# Altium project LED_CUBE_5x5x5.PrjPCB
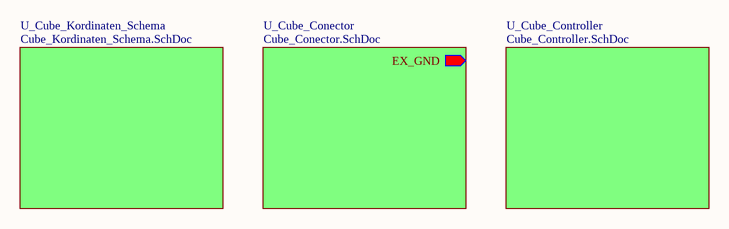
[diagram p0: main.SchDoc]
7 sheets, 116 parts. Net scope: hierarchical (ports join the sheet entries above them; power ports are global).
Board files: Cube_Connector.PcbDoc, Cube_Mainboard.PcbDoc
Sheets:
  main.SchDoc
    U_Cube_Kordinaten_Schema = Cube_Kordinaten_Schema.SchDoc
    U_Cube_Conector = Cube_Conector.SchDoc
    U_Cube_Controller = Cube_Controller.SchDoc
      U_LED_Treiber = LED_Treiber.SchDoc
      U_LED_GND_ZLayer_switch = LED_GND_ZLayer_switch.SchDoc
      U_USB_Programmer = USB_Programmer.SchDoc

## Sheet main.SchDoc
size A4

### Sub-sheets
U_Cube_Conector = Cube_Conector.SchDoc: EX_GND (out)
U_Cube_Controller = Cube_Controller.SchDoc: no entries
U_Cube_Kordinaten_Schema = Cube_Kordinaten_Schema.SchDoc: no entries

## Sheet Cube_Kordinaten_Schema.SchDoc
size A2
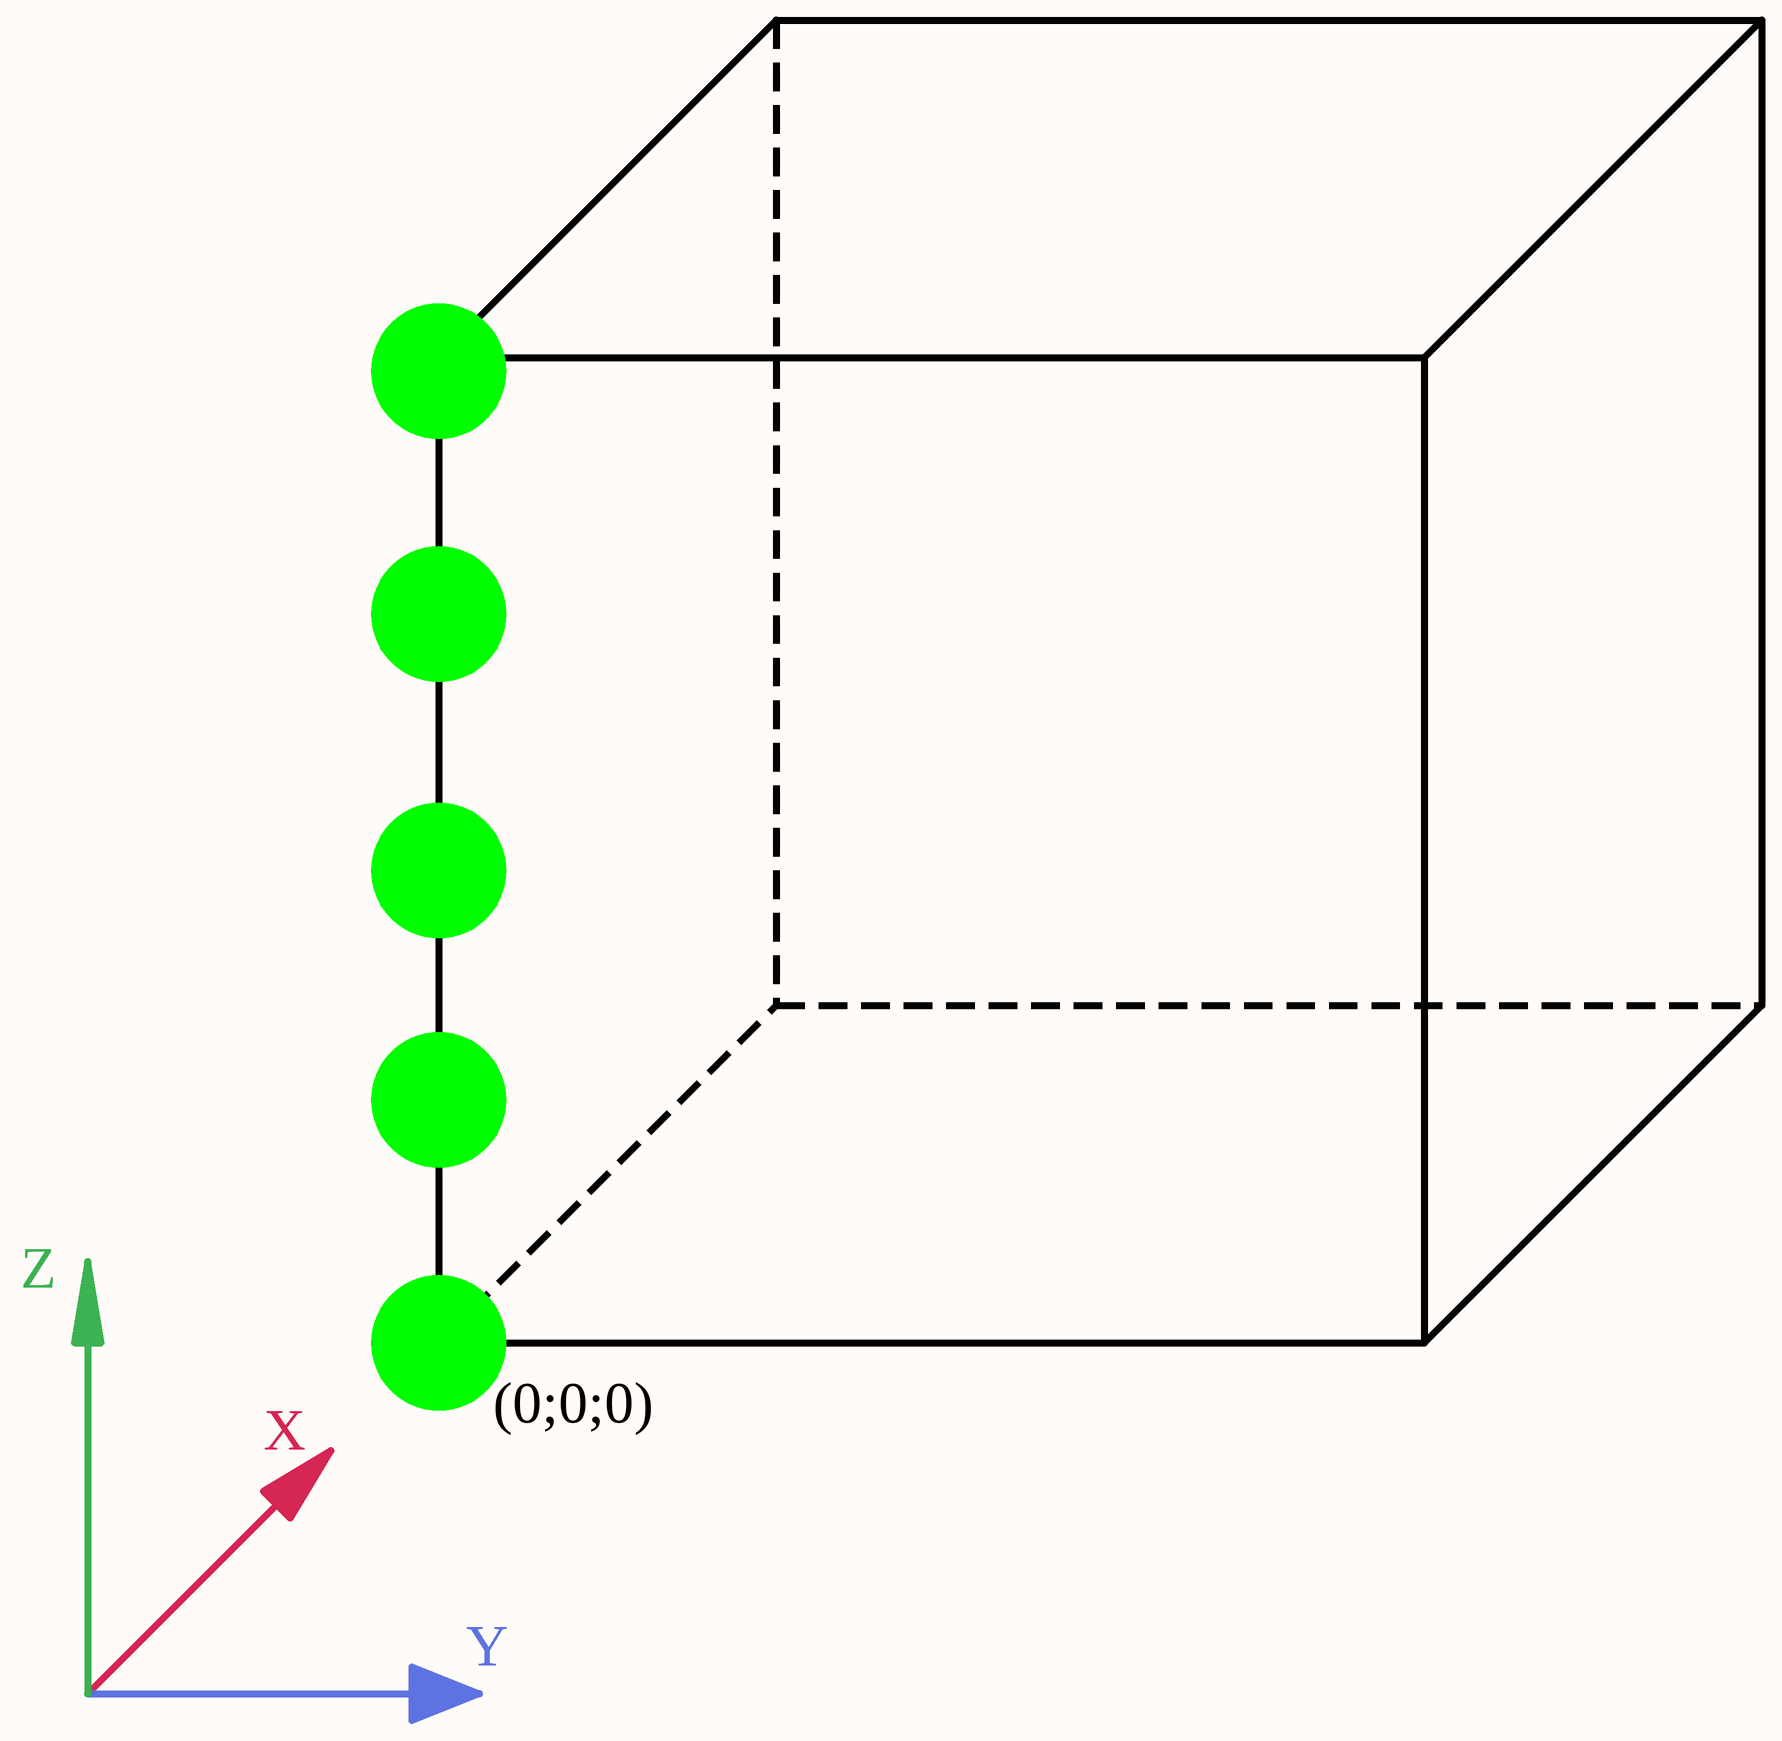
[diagram p1: Cube_Kordinaten_Schema.SchDoc]

### Notes on the sheet
- Z
- X
- (0;0;0)
- Y

## Sheet Cube_Conector.SchDoc
size A2
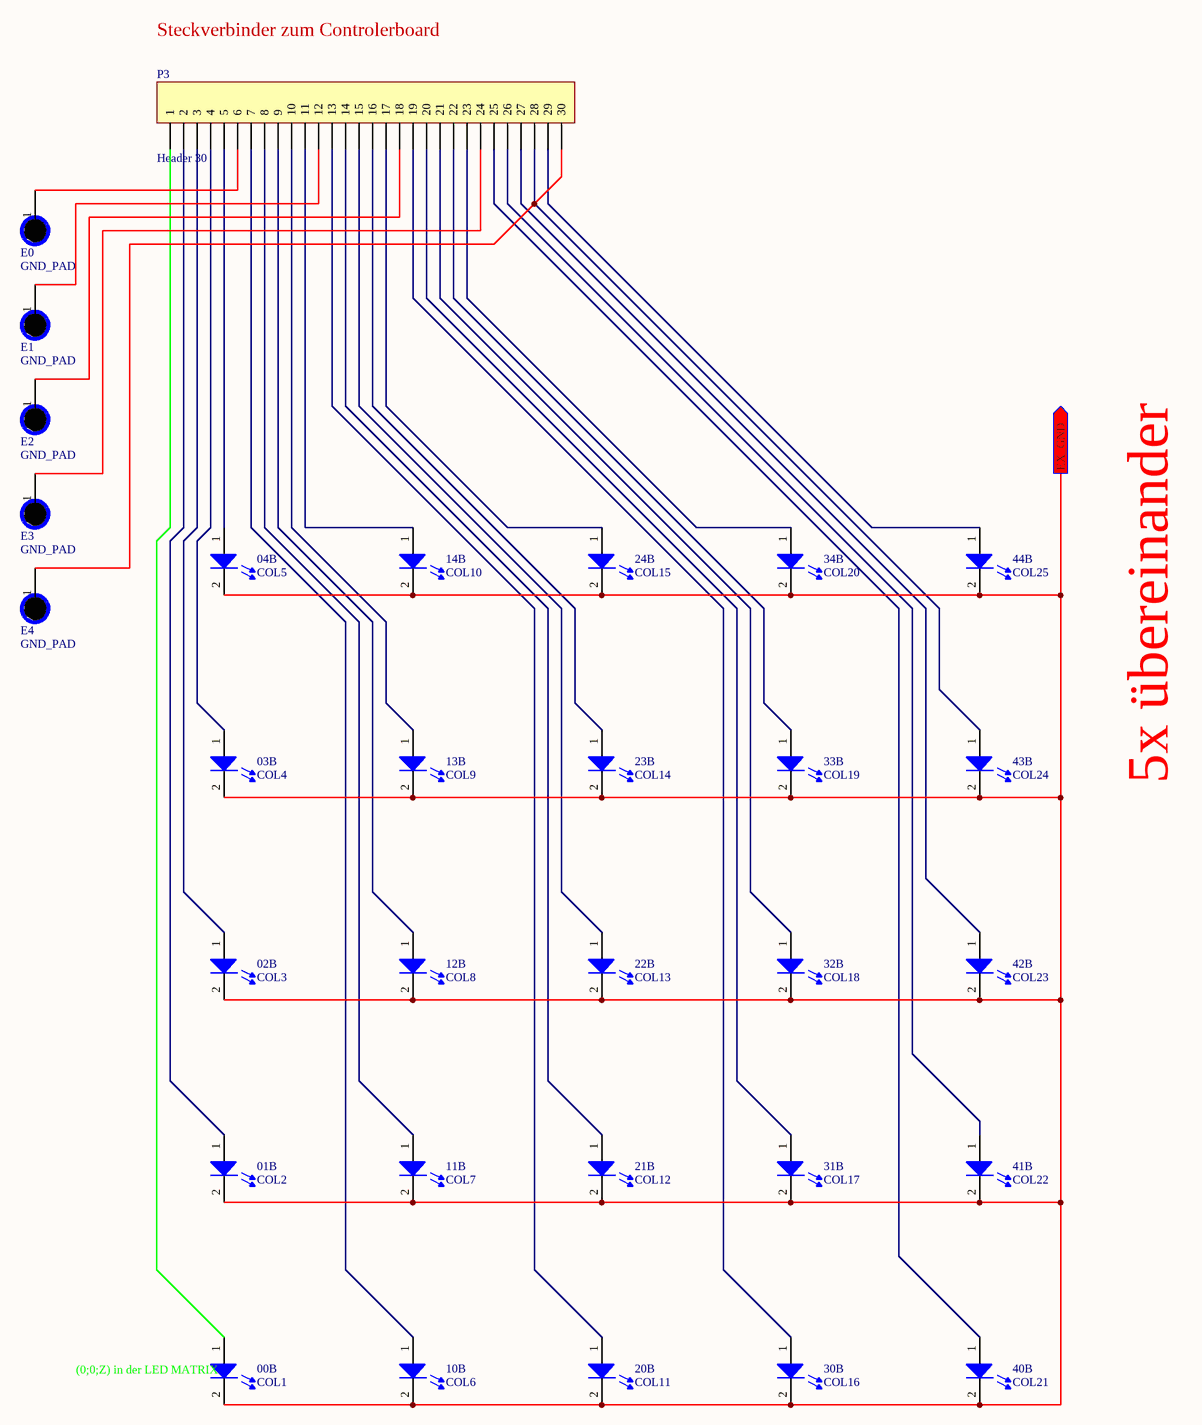
[diagram p2: Cube_Conector.SchDoc]

### Parts
00  COL1  [LED 3mm]  (part B of 2)
01  COL2  [LED 3mm]  (part B of 2)
02  COL3  [LED 3mm]  (part B of 2)
03  COL4  [LED 3mm]  (part B of 2)
04  COL5  [LED 3mm]  (part B of 2)
10  COL6  [LED 3mm]  (part B of 2)
11  COL7  [LED 3mm]  (part B of 2)
12  COL8  [LED 3mm]  (part B of 2)
13  COL9  [LED 3mm]  (part B of 2)
14  COL10  [LED 3mm]  (part B of 2)
20  COL11  [LED 3mm]  (part B of 2)
21  COL12  [LED 3mm]  (part B of 2)
22  COL13  [LED 3mm]  (part B of 2)
23  COL14  [LED 3mm]  (part B of 2)
24  COL15  [LED 3mm]  (part B of 2)
30  COL16  [LED 3mm]  (part B of 2)
31  COL17  [LED 3mm]  (part B of 2)
32  COL18  [LED 3mm]  (part B of 2)
33  COL19  [LED 3mm]  (part B of 2)
34  COL20  [LED 3mm]  (part B of 2)
40  COL21  [LED 3mm]  (part B of 2)
41  COL22  [LED 3mm]  (part B of 2)
42  COL23  [LED 3mm]  (part B of 2)
43  COL24  [LED 3mm]  (part B of 2)
44  COL25  [LED 3mm]  (part B of 2)
E0  GND_PAD  [GND_PAD]
E1  GND_PAD  [GND_PAD]
E2  GND_PAD  [GND_PAD]
E3  GND_PAD  [GND_PAD]
E4  GND_PAD  [GND_PAD]
P3  Header 30  [HDR1X30]

### Ports
EX_GND (out)

### Nets
Net00_1: 00.1 P3.1
Net00_2: 00.2 01.2 02.2 03.2 04.2 10.2 11.2 12.2 13.2 14.2 20.2 21.2 22.2 23.2 24.2 30.2 31.2 32.2 33.2 34.2 40.2 41.2 42.2 43.2 44.2 ; port EX_GND
Net01_1: 01.1 P3.2
Net02_1: 02.1 P3.3
Net03_1: 03.1 P3.4
Net04_1: 04.1 P3.5
Net10_1: 10.1 P3.7
Net11_1: 11.1 P3.8
Net12_1: 12.1 P3.9
Net13_1: 13.1 P3.10
Net14_1: 14.1 P3.11
Net20_1: 20.1 P3.13
Net21_1: 21.1 P3.14
Net22_1: 22.1 P3.15
Net23_1: 23.1 P3.16
Net24_1: 24.1 P3.17
Net30_1: 30.1 P3.19
Net31_1: 31.1 P3.20
Net32_1: 32.1 P3.21
Net33_1: 33.1 P3.22
Net34_1: 34.1 P3.23
Net40_1: 40.1 P3.25
Net41_1: 41.1 P3.26
Net42_1: 42.1 P3.27
Net43_1: 43.1 E4.1(GND) P3.28 P3.30
Net44_1: 44.1 P3.29
NetE0_1: E0.1(GND) P3.6
NetE1_1: E1.1(GND) P3.12
NetE2_1: E2.1(GND) P3.18
NetE3_1: E3.1(GND) P3.24

### Notes on the sheet
- Steckverbinder zum Controlerboard
- 5x übereinander
- (near 00) (0;0;Z) in der LED MATRIX

### Library data of the parts
00 01 02 03 04 10-14 20-24 30-34 40-44 = LED Std: LED bedrahtet
P3 = Header 30: Header, 30-Pin; LatestRevisionDate: 17-Jul-2002; LatestRevisionNote: Re-released for DXP Platform.; Publisher: Altium Limited

## Sheet Cube_Controller.SchDoc
size A3; DrawnBy: Tobias Wulf
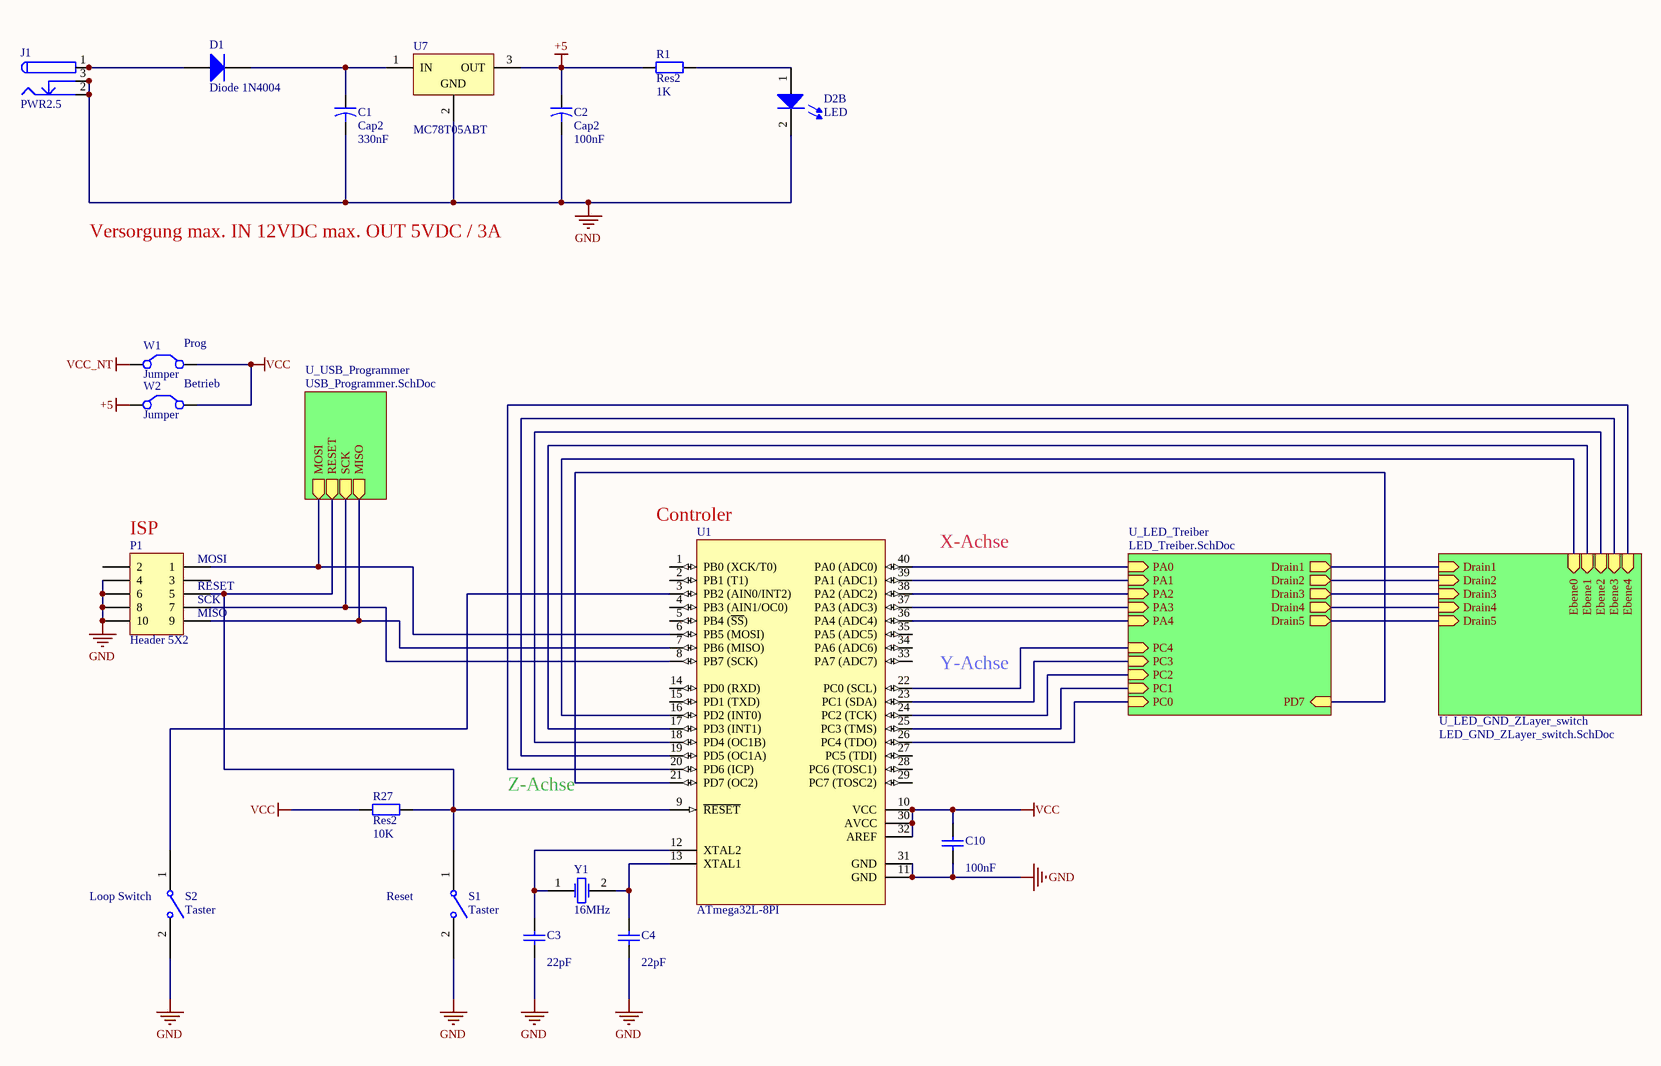
[diagram p3: Cube_Controller.SchDoc]

### Parts
C1  Cap2  value 330nF  [RAD-0.1]
C2  Cap2  value 100nF  [RAD-0.1]
C3  value 22pF  [RAD-0.1]  (hidden comment: Cap Semi)
C4  value 22pF  [RAD-0.1]  (hidden comment: Cap Semi)
C10  value 100nF  [RAD-0.1]  (hidden comment: Cap)
D1  Diode 1N4004  [DO-41]
D2  LED  [LED 3mm]  (part B of 2)
J1  PWR2.5  [KLD-0202]
P1  Header 5X2  [HDR2X5]
R1  Res2  value 1K  [AXIAL-0.4]
R27  Res2  value 10K  [AXIAL-0.4]
S1  Taster  [Taster]
S2  Taster  [Taster]
U1  ATmega32L-8PI  [40P6]
U7  MC78T05ABT  [221A-04]
W1  Jumper  [HDR1X2]
W2  Jumper  [HDR1X2]
Y1  16MHz  [Quarz HC49-4HL]

### Sub-sheets
U_LED_GND_ZLayer_switch = LED_GND_ZLayer_switch.SchDoc: Ebene0 (in), Ebene1 (in), Ebene2 (in), Ebene3 (in), Ebene4 (in), Drain1 (in), Drain2 (in), Drain3 (in), Drain4 (in), Drain5 (in)
U_LED_Treiber = LED_Treiber.SchDoc: PA0 (in), PA1 (in), PA2 (in), PA3 (in), PA4 (in), PC0 (in), PD7 (in), PC1 (in), PC2 (in), PC3 (in), PC4 (in), Drain1 (out), Drain2 (out), Drain3 (out), Drain4 (out), Drain5 (out)
U_USB_Programmer = USB_Programmer.SchDoc: MOSI (out), RESET (out), SCK (out), MISO (out)

### Nets
+5: C2.1 R1.1 U7.3(OUT) W2.1(C1)
GND: C1.2 C2.2 C3.1 C4.1 C10.1 D2.2 J1.2 J1.2A J1.2B J1.3 J1.3A J1.3B P1.4 P1.6 P1.8 P1.10 S1.2 S2.2 U1.11(GND) U1.31(GND) U7.2(GND)
VCC: C10.2 R27.1 U1.10(VCC) U1.30(AVCC) U1.32(AREF) W1.2(C2) W2.2(C2)
VCC_NT: W1.1(C1)  [project net +5P]
NetC1_1: C1.1 D1.2(K) U7.1(IN)
NetC3_2: C3.2 U1.12(XTAL2) Y1.1
NetC4_2: C4.2 U1.13(XTAL1) Y1.2
NetD1_1: D1.1(A) J1.1 J1.1A J1.1B
NetD2_1: D2.1 R1.2
NetP1_1: P1.1 U1.6(PB5_(MOSI)) ; sheet U_USB_Programmer/MOSI
NetP1_5: P1.5 R27.2 S1.1 U1.9(~{RESET}) ; sheet U_USB_Programmer/RESET
NetP1_7: P1.7 U1.8(PB7_(SCK)) ; sheet U_USB_Programmer/SCK
NetP1_9: P1.9 U1.7(PB6_(MISO)) ; sheet U_USB_Programmer/MISO
NetP2_6: sheet U_LED_Treiber/Drain1, sheet U_LED_GND_ZLayer_switch/Drain1
NetP2_12: sheet U_LED_Treiber/Drain2, sheet U_LED_GND_ZLayer_switch/Drain2
NetP2_18: sheet U_LED_Treiber/Drain3, sheet U_LED_GND_ZLayer_switch/Drain3
NetP2_24: sheet U_LED_Treiber/Drain4, sheet U_LED_GND_ZLayer_switch/Drain4
NetP2_30: sheet U_LED_Treiber/Drain5, sheet U_LED_GND_ZLayer_switch/Drain5
NetR28_1: U1.16(PD2_(INT0)) ; sheet U_LED_GND_ZLayer_switch/Ebene0
NetR29_1: U1.17(PD3_(INT1)) ; sheet U_LED_GND_ZLayer_switch/Ebene1
NetR30_1: U1.18(PD4_(OC1B)) ; sheet U_LED_GND_ZLayer_switch/Ebene2
NetR31_1: U1.19(PD5_(OC1A)) ; sheet U_LED_GND_ZLayer_switch/Ebene3
NetR32_1: U1.20(PD6_(ICP)) ; sheet U_LED_GND_ZLayer_switch/Ebene4
NetS2_1: S2.1 U1.3(PB2_(AIN0/INT2))
NetU1_21: U1.21(PD7_(OC2)) ; sheet U_LED_Treiber/PD7
NetU1_22: U1.22(PC0_(SCL)) ; sheet U_LED_Treiber/PC4
NetU1_23: U1.23(PC1_(SDA)) ; sheet U_LED_Treiber/PC3
NetU1_24: U1.24(PC2_(TCK)) ; sheet U_LED_Treiber/PC2
NetU1_25: U1.25(PC3_(TMS)) ; sheet U_LED_Treiber/PC1
NetU1_26: U1.26(PC4_(TDO)) ; sheet U_LED_Treiber/PC0
NetU1_36: U1.36(PA4_(ADC4)) ; sheet U_LED_Treiber/PA4
NetU1_37: U1.37(PA3_(ADC3)) ; sheet U_LED_Treiber/PA3
NetU1_38: U1.38(PA2_(ADC2)) ; sheet U_LED_Treiber/PA2
NetU1_39: U1.39(PA1_(ADC1)) ; sheet U_LED_Treiber/PA1
NetU1_40: U1.40(PA0_(ADC0)) ; sheet U_LED_Treiber/PA0

Not connected (* = marked no-connect by the designer): P1 2 3; U1 1(PB0_(XCK/T0)) 2(PB1_(T1)) 4(PB3_(AIN1/OC0)) 5(PB4_(~{SS})) 14(PD0_(RXD)) 15(PD1_(TXD)) 27(PC5_(TDI)) 28(PC6_(TOSC1)) 29(PC7_(TOSC2)) 33(PA7_(ADC7)) 34(PA6_(ADC6)) 35(PA5_(ADC5))

### Notes on the sheet
- Versorgung max. IN 12VDC max. OUT 5VDC / 3A
- (near W1) Prog
- Betrieb
- (near U1) Controler
- (near P1) ISP
- (near P1) RESET
- (near P1) MOSI
- X-Achse
- (near P1) MISO
- (near P1) SCK
- Y-Achse
- Z-Achse
- (near S2) Loop Switch
- (near S1) Reset

### Library data of the parts
C1 C2 = Cap2: Capacitor; Published: 23-Sep-2002; PackageReference: CAPR5-4X5; Publisher: Altium Limited; PackageDescription: Capacitor; 2 Leads
C3 C4 = Cap Semi: Capacitor (Semiconductor SIM Model); Published: 8-Jun-2000; LatestRevisionDate: 29-May-2009; LatestRevisionNote: IPC-7351 Footprint Added.; PackageReference: C1206; Publisher: Altium Limited; PackageDescription: Chip Capacitor
C10 = Cap: Capacitor; Published: 8-Jun-2000; LatestRevisionDate: 17-Jul-2002; LatestRevisionNote: Re-released for DXP Platform.; PackageReference: RAD-0.3; Publisher: Altium Limited; PackageDescription: Radial Cap, Thru-Hole; 2 Leads; 0.3 in Pin Spacing
D1 = Diode 1N4004: 1 Amp General Purpose Rectifier; Published: 8-Jun-2000; LatestRevisionDate: 17-Jul-2002; LatestRevisionNote: Re-released for DXP Platform.; DatasheetVersion: 1998; PackageVersion: Aug-1999; PackageReference: DO-41; Publisher: Altium Limited; PackageDescription: Diode, Axial; Body 5.2 x 2.7 mm (LxDia. max), Lead Dia. 0.86 mm (max); Code_JEDEC: DO-204-AL; ComponentLink1Description: Manufacturer Link; ComponentLink1URL: http://www.fairchildsemi.com/; ComponentLink2Description: Datasheet; ComponentLink2URL: http://www.fairchildsemi.com/ds/1N%2F1N4001.pdf
D2 = LED Std: LED bedrahtet
J1 = PWR2.5: Low Voltage Power Supply Connector; Published: 17-Dec-2003; DatasheetDocument: 09-May-2002; Publisher: Altium Limited; ComponentLink1Description: Manufacturer Link; ComponentLink1URL: http://domino.kycon.com/internet/Products.html
P1 = Header 5X2: Header, 5-Pin, Dual row; LatestRevisionDate: 17-Jul-2002; LatestRevisionNote: Re-released for DXP Platform.; Publisher: Altium Limited
R1 R27 = Res2: Resistor; Published: 8-Jun-2000; LatestRevisionDate: 17-Jul-2002; LatestRevisionNote: Re-released for DXP Platform.; PackageReference: AXIAL-0.4; Publisher: Altium Limited; PackageDescription: Axial Device, Thru-Hole; 2 Leads; 0.4 in Pin Spacing
U1 = ATmega32L-8PI: 8-Bit AVR Microcontroller with 32K Bytes of In-System Programmable Flash Memory; Published: 17-Sep-2003; LatestRevisionDate: 04-Mar-2005; LatestRevisionNote: Stylized 3D Model Added.; DatasheetVersion: 2503C-AVR-10/02; PackageVersion: Dec-1999; PackageReference: 40P6; Publisher: Altium Limited; PackageDescription: DIP; 40 Leads; Row Spacing 15.24 mm; Pitch 2.54 mm; ComponentLink1Description: Manufacturer Link; ComponentLink1URL: http://www.atmel.com; ComponentLink2Description: Datasheet; ComponentLink2URL: http://www.atmel.com/dyn/resources/prod_documents/doc2503.pdf
U7 = MC78T05ABT: Three-Ampere Positive Fixed Voltage Regulator; Note: Pin 2 is electrically connected to TAB; Published: 17-Jul-2002; DatasheetVersion: 1988; PackageReference: 221A-04; Publisher: Altium Limited; PackageDescription: TO, Thru-Hole, Vertical, Heatsink Mounted; 3 In-Line Leads; Pitch 2.54 mm; ComponentLink1Description: Manufacturer Link; ComponentLink1URL: http://www.onsemi.com/site/products/taxonomy/0,4438,503,00.html; ComponentLink2Description: Datasheet; ComponentLink2URL: http://www.onsemi.com/pub/Collateral/MC78T00-D.PDF; Code_JEDEC: TO-262-AA
W1 W2 = Jumper: Jumper Wire; Published: 24-Mar-1999; LatestRevisionDate: 17-Jul-2002; LatestRevisionNote: Re-released for DXP Platform.; PackageReference: RAD-0.2; Publisher: Altium Limited; PackageDescription: Radial Cap, Thru-Hole; 2 Leads; 0.2 in Pin Spacing
Y1 = Quarz HC49-4HL

## Sheet LED_Treiber.SchDoc
size A2
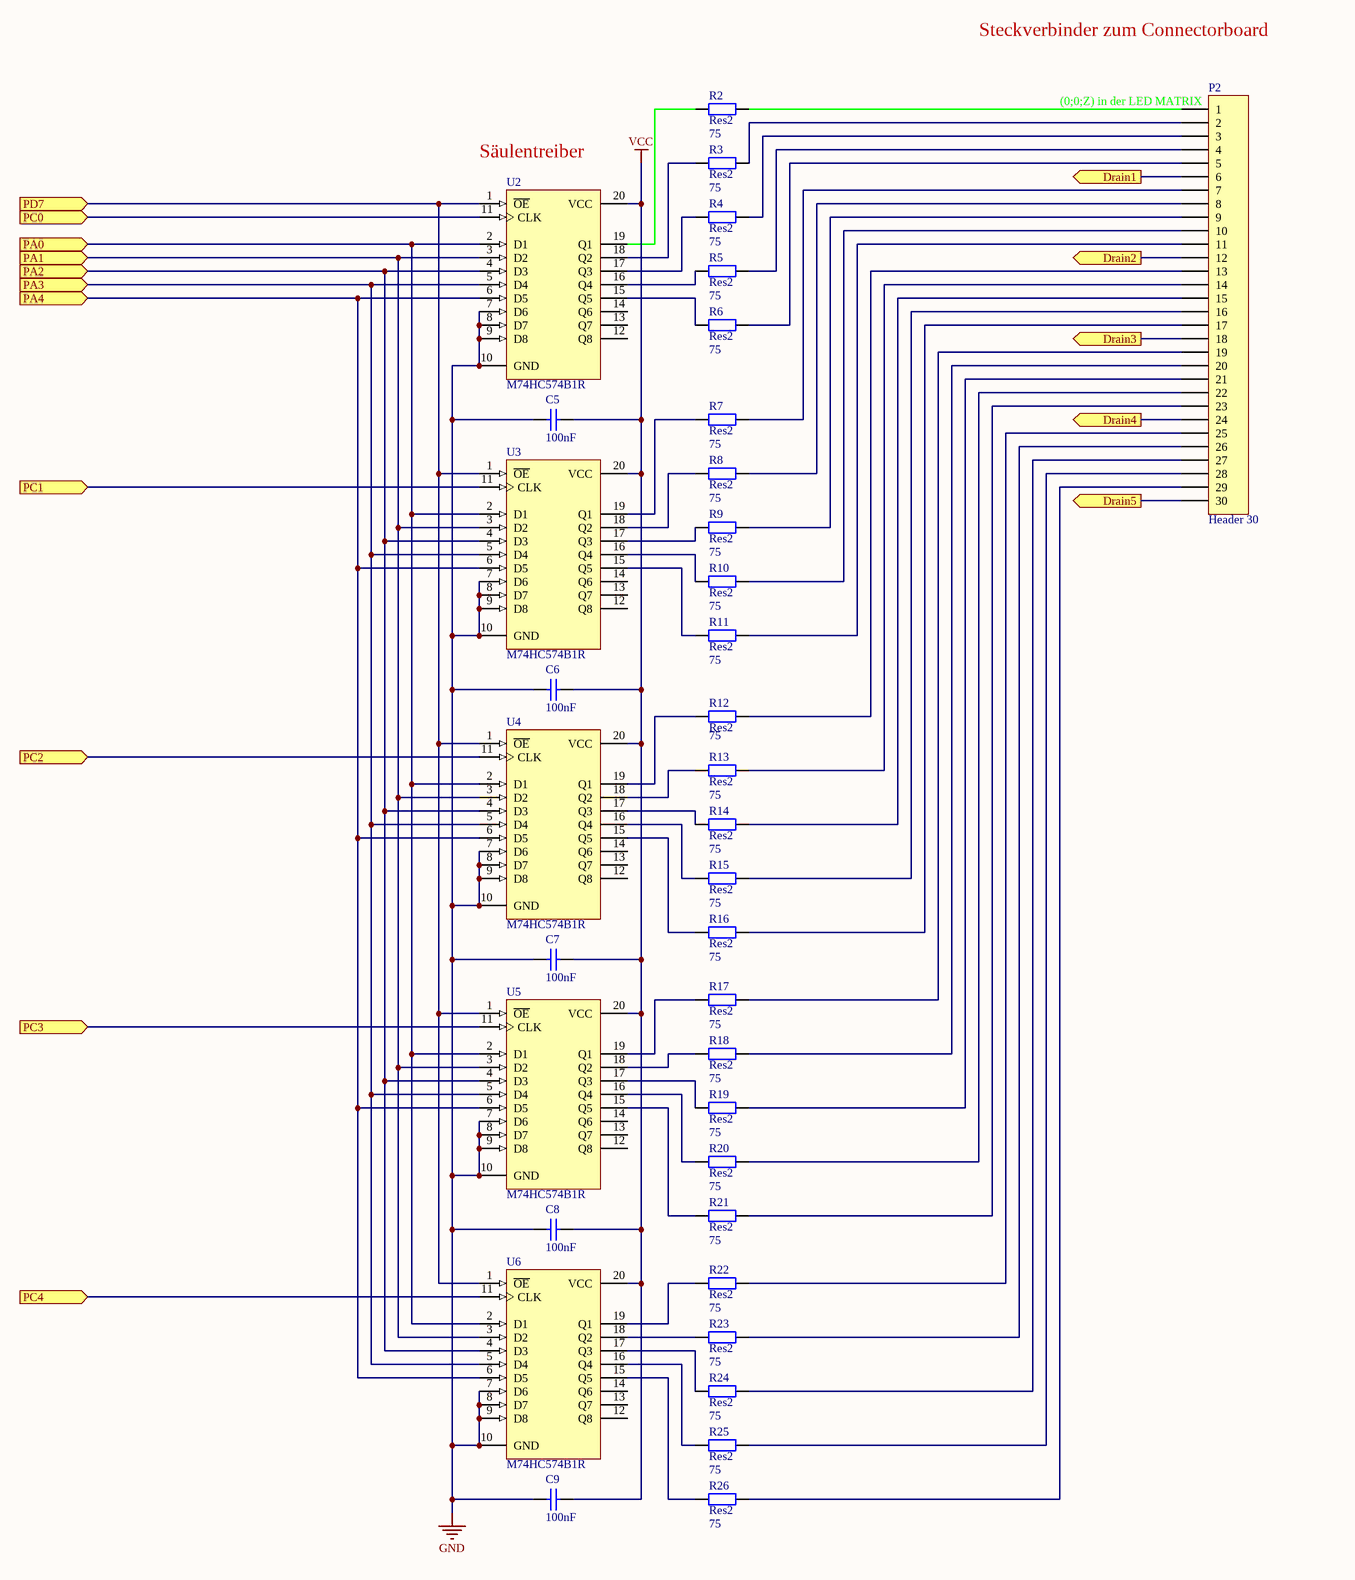
[diagram p4: LED_Treiber.SchDoc]

### Parts
C5  value 100nF  [R38]  (hidden comment: Cap)
C6  value 100nF  [R38]  (hidden comment: Cap)
C7  value 100nF  [R38]  (hidden comment: Cap)
C8  value 100nF  [R38]  (hidden comment: Cap)
C9  value 100nF  [R38]  (hidden comment: Cap)
P2  Header 30  [HDR1X30]
R2  Res2  value 75  [R38]
R3  Res2  value 75  [R38]
R4  Res2  value 75  [R38]
R5  Res2  value 75  [R38]
R6  Res2  value 75  [R38]
R7  Res2  value 75  [R38]
R8  Res2  value 75  [R38]
R9  Res2  value 75  [R38]
R10  Res2  value 75  [R38]
R11  Res2  value 75  [R38]
R12  Res2  value 75  [R38]
R13  Res2  value 75  [R38]
R14  Res2  value 75  [R38]
R15  Res2  value 75  [R38]
R16  Res2  value 75  [R38]
R17  Res2  value 75  [R38]
R18  Res2  value 75  [R38]
R19  Res2  value 75  [R38]
R20  Res2  value 75  [R38]
R21  Res2  value 75  [R38]
R22  Res2  value 75  [R38]
R23  Res2  value 75  [R38]
R24  Res2  value 75  [R38]
R25  Res2  value 75  [R38]
R26  Res2  value 75  [R38]
U2  M74HC574B1R  [DIP20]
U3  M74HC574B1R  [DIP20]
U4  M74HC574B1R  [DIP20]
U5  M74HC574B1R  [DIP20]
U6  M74HC574B1R  [DIP20]

### Ports
Drain1 (out), Drain2 (out), Drain3 (out), Drain4 (out), Drain5 (out), PA0 (in), PA1 (in), PA2 (in), PA3 (in), PA4 (in), PC0 (in), PC1 (in), PC2 (in), PC3 (in), PC4 (in), PD7 (in)

### Nets
GND: C5.1 C6.1 C7.1 C8.1 C9.1 U2.7(D6) U2.8(D7) U2.9(D8) U2.10(GND) U3.7(D6) U3.8(D7) U3.9(D8) U3.10(GND) U4.7(D6) U4.8(D7) U4.9(D8) U4.10(GND) U5.7(D6) U5.8(D7) U5.9(D8) U5.10(GND) U6.7(D6) U6.8(D7) U6.9(D8) U6.10(GND)
VCC: C5.2 C6.2 C7.2 C8.2 C9.2 U2.20(VCC) U3.20(VCC) U4.20(VCC) U5.20(VCC) U6.20(VCC)
NetP2_1: P2.1 R2.2
NetP2_2: P2.2 R3.2
NetP2_3: P2.3 R4.2
NetP2_4: P2.4 R5.2
NetP2_5: P2.5 R6.2
NetP2_6: P2.6 ; port Drain1
NetP2_7: P2.7 R7.2
NetP2_8: P2.8 R8.2
NetP2_9: P2.9 R9.2
NetP2_10: P2.10 R10.2
NetP2_11: P2.11 R11.2
NetP2_12: P2.12 ; port Drain2
NetP2_13: P2.13 R12.2
NetP2_14: P2.14 R13.2
NetP2_15: P2.15 R14.2
NetP2_16: P2.16 R15.2
NetP2_17: P2.17 R16.2
NetP2_18: P2.18 ; port Drain3
NetP2_19: P2.19 R17.2
NetP2_20: P2.20 R18.2
NetP2_21: P2.21 R19.2
NetP2_22: P2.22 R20.2
NetP2_23: P2.23 R21.2
NetP2_24: P2.24 ; port Drain4
NetP2_25: P2.25 R22.2
NetP2_26: P2.26 R23.2
NetP2_27: P2.27 R24.2
NetP2_28: P2.28 R25.2
NetP2_29: P2.29 R26.2
NetP2_30: P2.30 ; port Drain5
NetR2_1: R2.1 U2.19(Q1)
NetR3_1: R3.1 U2.18(Q2)
NetR4_1: R4.1 U2.17(Q3)
NetR5_1: R5.1 U2.16(Q4)
NetR6_1: R6.1 U2.15(Q5)
NetR7_1: R7.1 U3.19(Q1)
NetR8_1: R8.1 U3.18(Q2)
NetR9_1: R9.1 U3.17(Q3)
NetR10_1: R10.1 U3.16(Q4)
NetR11_1: R11.1 U3.15(Q5)
NetR12_1: R12.1 U4.19(Q1)
NetR13_1: R13.1 U4.18(Q2)
NetR14_1: R14.1 U4.17(Q3)
NetR15_1: R15.1 U4.16(Q4)
NetR16_1: R16.1 U4.15(Q5)
NetR17_1: R17.1 U5.19(Q1)
NetR18_1: R18.1 U5.18(Q2)
NetR19_1: R19.1 U5.17(Q3)
NetR20_1: R20.1 U5.16(Q4)
NetR21_1: R21.1 U5.15(Q5)
NetR22_1: R22.1 U6.19(Q1)
NetR23_1: R23.1 U6.18(Q2)
NetR24_1: R24.1 U6.17(Q3)
NetR25_1: R25.1 U6.16(Q4)
NetR26_1: R26.1 U6.15(Q5)
NetU1_21: U2.1(~{OE}) U3.1(~{OE}) U4.1(~{OE}) U5.1(~{OE}) U6.1(~{OE}) ; port PD7
NetU1_22: U6.11(CLK) ; port PC4
NetU1_23: U5.11(CLK) ; port PC3
NetU1_24: U4.11(CLK) ; port PC2
NetU1_25: U3.11(CLK) ; port PC1
NetU1_26: U2.11(CLK) ; port PC0
NetU1_36: U2.6(D5) U3.6(D5) U4.6(D5) U5.6(D5) U6.6(D5) ; port PA4
NetU1_37: U2.5(D4) U3.5(D4) U4.5(D4) U5.5(D4) U6.5(D4) ; port PA3
NetU1_38: U2.4(D3) U3.4(D3) U4.4(D3) U5.4(D3) U6.4(D3) ; port PA2
NetU1_39: U2.3(D2) U3.3(D2) U4.3(D2) U5.3(D2) U6.3(D2) ; port PA1
NetU1_40: U2.2(D1) U3.2(D1) U4.2(D1) U5.2(D1) U6.2(D1) ; port PA0

Not connected (* = marked no-connect by the designer): U2 12(Q8) 13(Q7) 14(Q6); U3 12(Q8) 13(Q7) 14(Q6); U4 12(Q8) 13(Q7) 14(Q6); U5 12(Q8) 13(Q7) 14(Q6); U6 12(Q8) 13(Q7) 14(Q6)

### Notes on the sheet
- Steckverbinder zum Connectorboard
- (near P2) (0;0;Z) in der LED MATRIX
- (near U2) Säulentreiber

### Library data of the parts
C5-C9 = Cap: Capacitor; Published: 8-Jun-2000; LatestRevisionDate: 17-Jul-2002; LatestRevisionNote: Re-released for DXP Platform.; PackageReference: RAD-0.3; Publisher: Altium Limited; PackageDescription: Radial Cap, Thru-Hole; 2 Leads; 0.3 in Pin Spacing
P2 = Header 30: Header, 30-Pin; LatestRevisionDate: 17-Jul-2002; LatestRevisionNote: Re-released for DXP Platform.; Publisher: Altium Limited
R2-R26 = Res2: Resistor; Published: 8-Jun-2000; LatestRevisionDate: 17-Jul-2002; LatestRevisionNote: Re-released for DXP Platform.; PackageReference: AXIAL-0.4; Publisher: Altium Limited; PackageDescription: Axial Device, Thru-Hole; 2 Leads; 0.4 in Pin Spacing
U2-U6 = M74HC574B1R: Octal D-Type Flip-Flop with 3-State Output Non-Inverting; Published: 8-Jun-2000; LatestRevisionDate: 06-Jun-2005; LatestRevisionNote: Stylized 3D Model Added.; DatasheetVersion: Mar-1993; PackageVersion: Jun-1998; PackageReference: DIP20; Publisher: Altium Limited; PackageDescription: DIP; 20 Leads; Row Spacing 7.62 mm; Pitch 2.54 mm; Code_JEDEC: MS-015-AE; ComponentLink1Description: Manufacturer Link; ComponentLink1URL: http://www.st.com/; ComponentLink2Description: Datasheet; ComponentLink2URL: http://www.st.com/stonline/products/literature/ds/8025/m74hc574.pdf

## Sheet LED_GND_ZLayer_switch.SchDoc
size A4
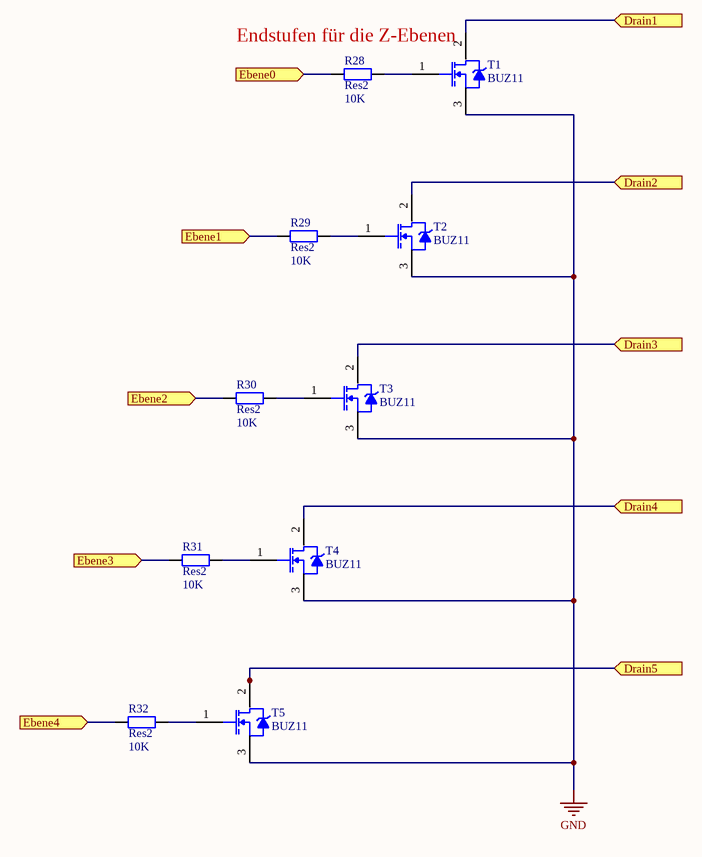
[diagram p5: LED_GND_ZLayer_switch.SchDoc]

### Parts
R28  Res2  value 10K  [AXIAL-0.4]
R29  Res2  value 10K  [AXIAL-0.4]
R30  Res2  value 10K  [AXIAL-0.4]
R31  Res2  value 10K  [AXIAL-0.4]
R32  Res2  value 10K  [AXIAL-0.4]
T1  BUZ11  [TO220]
T2  BUZ11  [TO220]
T3  BUZ11  [TO220]
T4  BUZ11  [TO220]
T5  BUZ11  [TO220]

### Ports
Drain1 (in), Drain2 (in), Drain3 (in), Drain4 (in), Drain5 (in), Ebene0 (in), Ebene1 (in), Ebene2 (in), Ebene3 (in), Ebene4 (in)

### Nets
GND: T1.3(S) T2.3(S) T3.3(S) T4.3(S) T5.3(S)
NetP2_6: T1.2(D) ; port Drain1
NetP2_12: T2.2(D) ; port Drain2
NetP2_18: T3.2(D) ; port Drain3
NetP2_24: T4.2(D) ; port Drain4
NetP2_30: T5.2(D) ; port Drain5
NetR28_1: R28.1 ; port Ebene0
NetR28_2: R28.2 T1.1(G)
NetR29_1: R29.1 ; port Ebene1
NetR29_2: R29.2 T2.1(G)
NetR30_1: R30.1 ; port Ebene2
NetR30_2: R30.2 T3.1(G)
NetR31_1: R31.1 ; port Ebene3
NetR31_2: R31.2 T4.1(G)
NetR32_1: R32.1 ; port Ebene4
NetR32_2: R32.2 T5.1(G)

### Notes on the sheet
- (near T1) Endstufen für die Z-Ebenen

### Library data of the parts
R28-R32 = Res2: Resistor; Published: 8-Jun-2000; LatestRevisionDate: 17-Jul-2002; LatestRevisionNote: Re-released for DXP Platform.; PackageReference: AXIAL-0.4; Publisher: Altium Limited; PackageDescription: Axial Device, Thru-Hole; 2 Leads; 0.4 in Pin Spacing
T1-T5 = N-MOSFET: MOSFET

## Sheet USB_Programmer.SchDoc
size A3
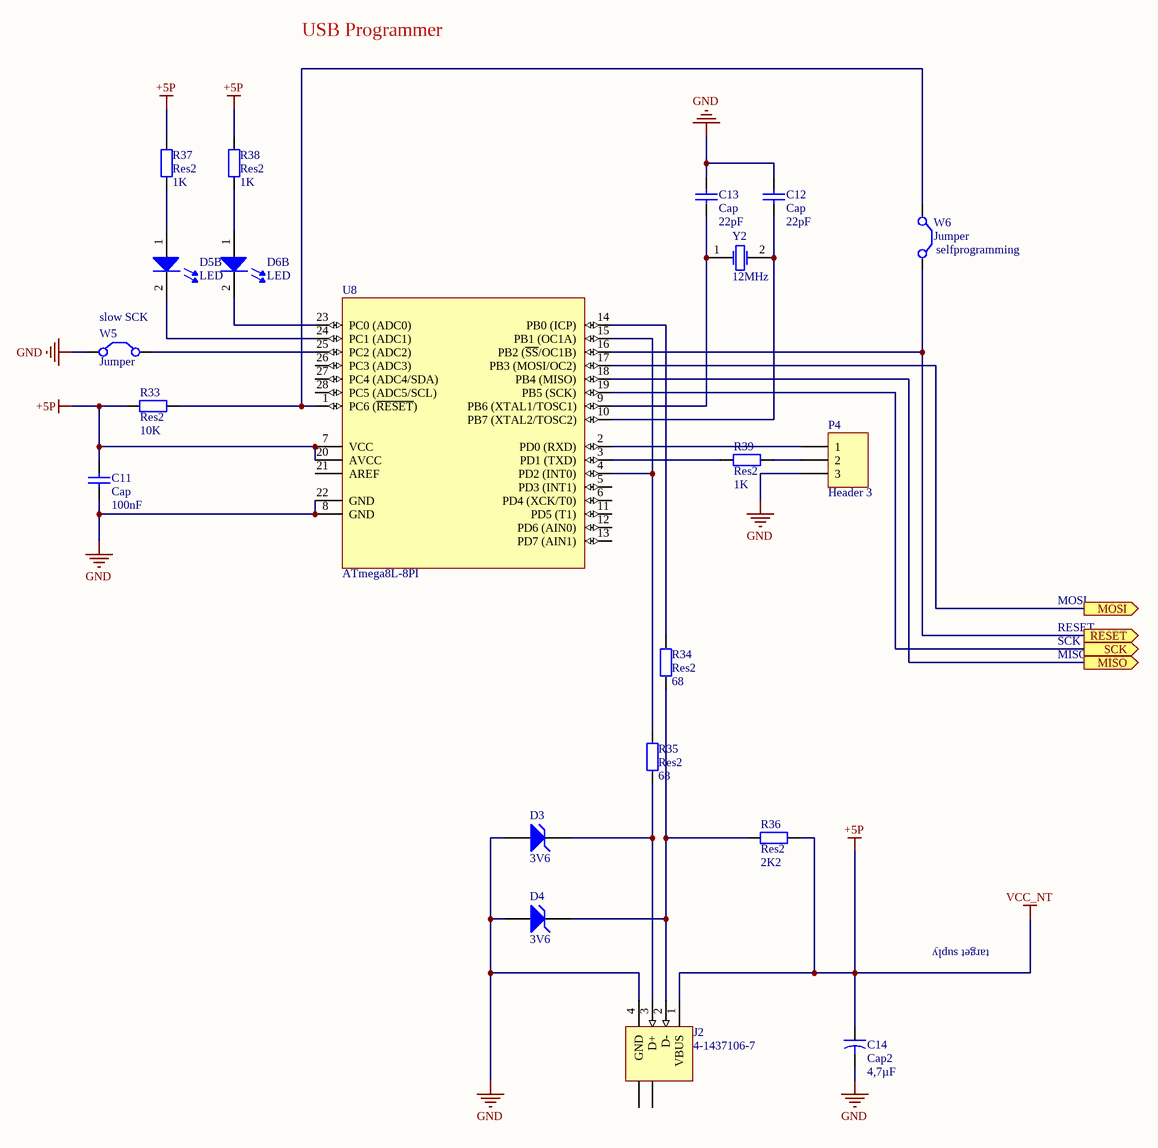
[diagram p6: USB_Programmer.SchDoc]

### Parts
C11  Cap  value 100nF  [RAD-0.1]
C12  Cap  value 22pF  [RAD-0.1]
C13  Cap  value 22pF  [RAD-0.1]
C14  Cap2  value 4,7µF  [CAPR5-4X5]
D3  3V6  [DO-7]
D4  3V6  [DO-7]
D5  LED  [LED 3mm]  (part B of 2)
D6  LED  [LED 3mm]  (part B of 2)
J2  4-1437106-7  [1437106]
P4  Header 3  [HDR1X3]
R33  Res2  value 10K  [AXIAL-0.4]
R34  Res2  value 68  [AXIAL-0.4]
R35  Res2  value 68  [AXIAL-0.4]
R36  Res2  value 2K2  [AXIAL-0.4]
R37  Res2  value 1K  [AXIAL-0.4]
R38  Res2  value 1K  [AXIAL-0.4]
R39  Res2  value 1K  [AXIAL-0.4]
U8  ATmega8L-8PI  [28P3]
W5  Jumper  [HDR1X2]
W6  Jumper  [HDR1X2]
Y2  12MHz  [Quarz HC49-4HL]

### Ports
MISO (out), MOSI (out), RESET (out), SCK (out)

### Nets
+5P: C11.2 C14.1 J2.1(VBUS) R33.1 R36.2 R37.2 R38.2 U8.7(VCC) U8.20(AVCC)  [also labelled VCC_NT]
GND: C11.1 C12.1 C13.1 C14.2 D3.1(A) D4.1(A) J2.4(GND) P4.3 U8.8(GND) U8.22(GND) W5.1(C1)
NetC12_2: C12.2 U8.10(PB7_(XTAL2/TOSC2)) Y2.2
NetC13_2: C13.2 U8.9(PB6_(XTAL1/TOSC1)) Y2.1
NetD3_2: D3.2(K) J2.3(D+) R35.2
NetD4_2: D4.2(K) J2.2(D-) R34.2 R36.1
NetD5_1: D5.1 R37.1
NetD5_2: D5.2 U8.24(PC1_(ADC1))
NetD6_1: D6.1 R38.1
NetD6_2: D6.2 U8.23(PC0_(ADC0))
NetP1_1: U8.17(PB3_(MOSI/OC2)) ; port MOSI
NetP1_5: U8.16(PB2_(~{SS}/OC1B)) W6.2(C2) ; port RESET
NetP1_7: U8.19(PB5_(SCK)) ; port SCK
NetP1_9: U8.18(PB4_(MISO)) ; port MISO
NetP4_1: P4.1 U8.2(PD0_(RXD))
NetP4_2: P4.2 R39.2
NetR33_2: R33.2 U8.1(PC6_(~{RESET})) W6.1(C1)
NetR34_1: R34.1 U8.14(PB0_(ICP))
NetR35_1: R35.1 U8.4(PD2_(INT0)) U8.15(PB1_(OC1A))
NetR39_1: R39.1 U8.3(PD1_(TXD))
NetU8_25: U8.25(PC2_(ADC2)) W5.2(C2)

Not connected (* = marked no-connect by the designer): J2 5(SHLD) 6(SHLD); U8 5(PD3_(INT1)) 6(PD4_(XCK/T0)) 11(PD5_(T1)) 12(PD6_(AIN0)) 13(PD7_(AIN1)) 21(AREF) 26(PC3_(ADC3)) 27(PC4_(ADC4/SDA)) 28(PC5_(ADC5/SCL))

### Notes on the sheet
- USB Programmer
- (near W6) selfprogramming
- (near W5) slow SCK
- RESET
- MOSI
- MISO
- SCK
- target suply

### Library data of the parts
C11-C13 = Cap: Capacitor; Published: 8-Jun-2000; LatestRevisionDate: 17-Jul-2002; LatestRevisionNote: Re-released for DXP Platform.; PackageReference: RAD-0.3; Publisher: Altium Limited; PackageDescription: Radial Cap, Thru-Hole; 2 Leads; 0.3 in Pin Spacing
C14 = Cap2: Capacitor; Published: 23-Sep-2002; PackageReference: CAPR5-4X5; Publisher: Altium Limited; PackageDescription: Capacitor; 2 Leads
D3 D4 = D Zener: Zener Diode; Published: 8-Jun-2000; LatestRevisionDate: 17-Jul-2002; LatestRevisionNote: Re-released for DXP Platform.; PackageReference: DIODE-0.7; Publisher: Altium Limited; PackageDescription: Diode, Thru-Hole; 2 Leads; 0.7 in Pin Spacing
D5 D6 = LED Std: LED bedrahtet
J2 = 4-1437106-7: USB 1.1, Right Angle, Thru-Hole, B Type, Receptacle, 4 Position, White; ContactMaterial: Copper Alloy; ContactPlating: Gold (30); TerminationLength: 2.90mm [0.114in.]; PCB_Layout: Complies with manufacturer's recommendation.; DrillSize: Corresponds to nominal value.; PanelGround: Without; Published: 15-Jul-2004; DatasheetDocument: 05-Jan-2004; PackageDocument: 05-Jan-2004; PackageReference: 1437106; Publisher: Altium Limited; HousingMaterial: Glass-Filled Thermoplastic; ComponentLink1Description: Manufacturer Link; ComponentLink1URL: http://www.tycoelectronics.com/; ComponentLink2Description: Packaging Specification; ComponentLink2URL: http://ecommas.tycoelectronics.com/commerce/DocumentDelivery/DDEController?Action=showdoc&DocId=Customer+Drawing%7F1437106%7FC%7Ftif%7FEnglish%7FENG_CD_1437106_C.tif
P4 = Header 3: Header, 3-Pin; LatestRevisionDate: 17-Jul-2002; LatestRevisionNote: Re-released for DXP Platform.; Publisher: Altium Limited
R33-R39 = Res2: Resistor; Published: 8-Jun-2000; LatestRevisionDate: 17-Jul-2002; LatestRevisionNote: Re-released for DXP Platform.; PackageReference: AXIAL-0.4; Publisher: Altium Limited; PackageDescription: Axial Device, Thru-Hole; 2 Leads; 0.4 in Pin Spacing
U8 = ATmega8L-8PI: 8-Bit AVR Microcontroller with 8K Bytes of In-System Programmable Flash Memory; Published: 17-Sep-2003; LatestRevisionDate: 04-Mar-2005; LatestRevisionNote: Stylized 3D Model Added.; DatasheetVersion: 2486H-AVR-09/02; PackageVersion: revB, Sep-2001; PackageReference: 28P3; Publisher: Altium Limited; PackageDescription: DIP; 28 Leads; Row Spacing 7.62 mm; Pitch 2.54 mm; ComponentLink1Description: Manufacturer Link; ComponentLink1URL: http://www.atmel.com; ComponentLink2Description: Datasheet; ComponentLink2URL: http://www.atmel.com/dyn/resources/prod_documents/doc2486.pdf
W5 W6 = Jumper: Jumper Wire; Published: 24-Mar-1999; LatestRevisionDate: 17-Jul-2002; LatestRevisionNote: Re-released for DXP Platform.; PackageReference: RAD-0.2; Publisher: Altium Limited; PackageDescription: Radial Cap, Thru-Hole; 2 Leads; 0.2 in Pin Spacing
Y2 = Quarz HC49-4HL

## Nets that join several sheets
+5P: Cube_Controller (W1.1), USB_Programmer (9 pins)
GND: Cube_Controller (21 pins), LED_Treiber (25 pins), LED_GND_ZLayer_switch (5 pins), USB_Programmer (11 pins)
VCC: Cube_Controller (7 pins), LED_Treiber (10 pins)
NetP1_1: Cube_Controller (P1.1 U1.6), USB_Programmer (U8.17)
NetP1_5: Cube_Controller (P1.5 R27.2 S1.1 U1.9), USB_Programmer (U8.16 W6.2)
NetP1_7: Cube_Controller (P1.7 U1.8), USB_Programmer (U8.19)
NetP1_9: Cube_Controller (P1.9 U1.7), USB_Programmer (U8.18)
NetP2_6: LED_Treiber (P2.6), LED_GND_ZLayer_switch (T1.2)
NetP2_12: LED_Treiber (P2.12), LED_GND_ZLayer_switch (T2.2)
NetP2_18: LED_Treiber (P2.18), LED_GND_ZLayer_switch (T3.2)
NetP2_24: LED_Treiber (P2.24), LED_GND_ZLayer_switch (T4.2)
NetP2_30: LED_Treiber (P2.30), LED_GND_ZLayer_switch (T5.2)
NetR28_1: Cube_Controller (U1.16), LED_GND_ZLayer_switch (R28.1)
NetR29_1: Cube_Controller (U1.17), LED_GND_ZLayer_switch (R29.1)
NetR30_1: Cube_Controller (U1.18), LED_GND_ZLayer_switch (R30.1)
NetR31_1: Cube_Controller (U1.19), LED_GND_ZLayer_switch (R31.1)
NetR32_1: Cube_Controller (U1.20), LED_GND_ZLayer_switch (R32.1)
NetU1_21: Cube_Controller (U1.21), LED_Treiber (5 pins)
NetU1_22: Cube_Controller (U1.22), LED_Treiber (U6.11)
NetU1_23: Cube_Controller (U1.23), LED_Treiber (U5.11)
NetU1_24: Cube_Controller (U1.24), LED_Treiber (U4.11)
NetU1_25: Cube_Controller (U1.25), LED_Treiber (U3.11)
NetU1_26: Cube_Controller (U1.26), LED_Treiber (U2.11)
NetU1_36: Cube_Controller (U1.36), LED_Treiber (5 pins)
NetU1_37: Cube_Controller (U1.37), LED_Treiber (5 pins)
NetU1_38: Cube_Controller (U1.38), LED_Treiber (5 pins)
NetU1_39: Cube_Controller (U1.39), LED_Treiber (5 pins)
NetU1_40: Cube_Controller (U1.40), LED_Treiber (5 pins)